# Altium schematic sheet wireless_accelerometer.SchDoc
size A4; Organization: Altium Limited; Address1: L3, 12a Rodborough Rd; Address2: Frenchs Forest; Address3: NSW; Address4: Australia 2086
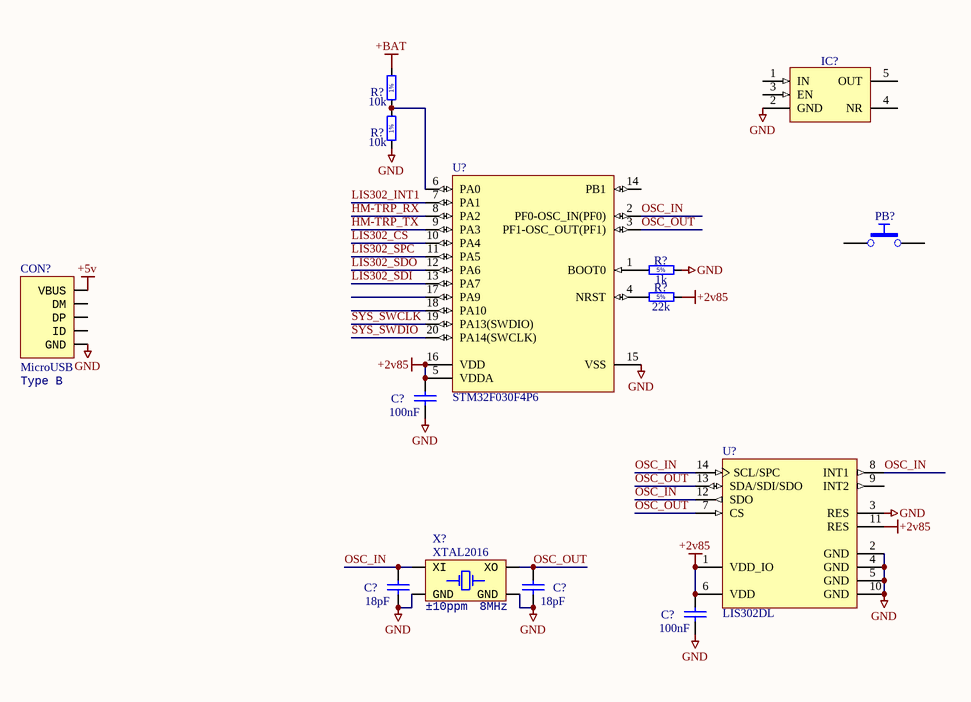
[diagram p0: wireless_accelerometer.SchDoc]

## Parts
(Parts that share a designator on the sheet are numbered #1, #2 ... from top to bottom, then left to right.)
C?#1  100nF  [CAP_0603]
C?#2  18pF  [CAP_0603]
C?#3  18pF  [CAP_0603]
C?#4  100nF  [CAP_0603]
CON?  MicroUSB  value Type B  [USB_Micro-AB]
IC?  TPS73033DBVT  [SOT95P280X145-5N]  (value not drawn)
PB?  Push Button  [PB_TYCO_FSMSM]  (value not drawn)
R?#1  10k  [RES_0603]
R?#2  10k  [RES_0603]
R?#3  1k  [RES_0603]
R?#4  22k  [RES_0603]
U?#1  STM32F030F4P6  [STM-TSSOP20_N]
U?#2  LIS302DL  [LGA14-3X5X1_N]
X?  XTAL2016  value 8MHz  Specification: ±10ppm  [XT_2016_4]

## Nets
+2v85: C?#1.2 C?#4.2 R?#4.2 U?#1.5(VDDA) U?#1.16(VDD) U?#2.1(VDD_IO) U?#2.6(VDD) U?#2.11(RES)
+5v: CON?.1(VBUS)
+BAT: R?#1.2
GND: C?#1.1 C?#2.1 C?#3.1 C?#4.1 CON?.5(GND) IC?.2(GND) R?#2.1 R?#3.2 U?#1.15(VSS) U?#2.2(GND) U?#2.3(RES) U?#2.4(GND) U?#2.5(GND) U?#2.10(GND) X?.2(GND) X?.4(GND)
HM-TRP_RX: U?#1.8(PA2)
HM-TRP_TX: U?#1.9(PA3)
LIS302_CS: U?#1.10(PA4)
LIS302_INT1: U?#1.7(PA1)
LIS302_SDI: U?#1.13(PA7)
LIS302_SDO: U?#1.12(PA6)
LIS302_SPC: U?#1.11(PA5)
OSC_IN: C?#2.2 U?#1.2(PF0-OSC_IN(PF0)) U?#2.8(INT1) U?#2.12(SDO) U?#2.14(SCL/SPC) X?.1(XI)
OSC_OUT: C?#3.2 U?#1.3(PF1-OSC_OUT(PF1)) U?#2.7(CS) U?#2.13(SDA/SDI/SDO) X?.3(XO)
SYS_SWCLK: U?#1.19(PA13(SWDIO))
SYS_SWDIO: U?#1.20(PA14(SWCLK))
NetR?#1_1: R?#1.1 R?#2.2 U?#1.6(PA0)
NetR?#3_1: R?#3.1 U?#1.1(BOOT0)
NetR?#4_1: R?#4.1 U?#1.4(NRST)

Not connected (* = marked no-connect by the designer): CON? 0(SH) 2(DM) 3(DP) 4(ID); IC? 1(IN) 3(EN) 4(NR) 5(OUT); PB? 1 2; U?#1 14(PB1) 17(PA9) 18(PA10); U?#2 9(INT2)

## Notes on the sheet
- Title
- Size:
- Date:
- A4
- Number:
- Time:
- Revision:
- Sheet
- of
- File:
- (in symbol Resistor - 1%) 1%
- (in symbol Resistor - 5%) 5%

## Library data of the parts
C?#1-C?#4 = Capacitor - non polarized: Non-polarised capacitor
CON? = USB_Micro: USB; Type: *; Link: *
IC? = TPS73033DBVT: Single Output LDO, 200mA, Fixed (3.3V), High PSRR, Low Noise; Part Description: Single Output LDO, 200mA, Fixed (3.3V), High PSRR, Low Noise Linear Regulator; Manufacturer: TEXAS INSTRUMENTS; Table: Regulators; Part Number: TPS73033DBVT; Component Kind: Standard; Component Type: Standard; Device: TPS73033DBVT; PackageDescription: SOT, 0.95mm pitch; 5 pin, 1.60mm W X 2.90mm L X 1.45mm H body, IPC Medium Density; Manufacturer Part Number: TPS73033DBVT; Pin Count: 5; Case: SOT23-5; Mounted: Yes; Socket: No; SMD: Yes; ComponentHeight: 1.45mm; HelpURL: \\cern.ch\dfs\Applications\Altium\Datasheets\TPS73033DBVT.pdf; Author: CERN DEM JLC; CreateDate: 26.01.2010; LatestRevisionDate: 26.01.2010
PB? = PB_TYCO_FSMSM: Push-Button Switch SPDT; Part Description: 12VDC 50mA SPST Tactile  Push-Button Switch; Manufacturer: TYCO ELECTRONICS; Manufacturer Part Number: FSMSM or 1437566-3; Table: Switches; Part Number: PB_TYCO_FSMSM; Component Kind: Standard; Component Type: Standard; Pin Count: 2; PackageDescription: Body 3.5x6.0mm, Pushbutton Switch,  TYCO ALCOSWITCH FSMSM Serie; Family: Push Button; Mounted: Yes; Socket: No; SMD: Yes; Status: None; ComponentHeight: 4.3mm; HelpURL: \\cern.ch\dfs\Applications\Altium\Datasheets\PB_TYCO_FSMSM.pdf; Author: CERN DEM JLC; CreateDate: 30.06.2008; LatestRevisionDate: 21.06.2012
R?#1 R?#2 = Resistor - 1%
R?#3 R?#4 = Resistor - 5%
U?#1 = STM32F030F4P6: ARM Cortex-M0 32-bit MCU, 16 KB Flash, 4 KB Internal RAM, 15 I/Os, 20-pin TSSOP, -40 to 85 degC, Tube; FLASH Size (Prog) (kB): 16; I/Os (High Current): 15; Internal RAM Size (kB): 4; Operating Frequency(F) (Processor speed) (MHz): 48; Supply Voltage(Vcc) min (V): 2.4; DatasheetVersion: Rev. 1; PackageVersion: Rev. 1, 11/2012; PackageReference: TSSOP20; PackageDescription: 20-Pin Thin Shrink Small Outline Package, 6.5 x 4.4 mm Body, 0.65 mm Pitch; Supplier 1: Digi-Key; Supplier Part Number 1: 497-14044-5-ND; Supplier 2: Newark; Supplier Part Number 2: 06X3648; Supplier 3: Mouser; Supplier Part Number 3: 511-STM32F030F4P6; Core: ARM Cortex-M0; Packing: Tube; Mounting Technology: Surface Mount; PartNumber: STM32F030F4P6; ComponentLink1Description: Manufacturer URL; ComponentLink1URL: http://www.st.com/web/en/home.html; ComponentLink2Description: Datasheet; ComponentLink2URL: http://www.st.com/st-web-ui/static/active/en/resource/technical/document/datasheet/DM00088500.pdf; ComponentLink3Description: Package Specification; ComponentLink3URL: http://www.st.com/st-web-ui/static/active/en/resource/technical/document/datasheet/DM00065136.pdf
U?#2 = LIS302DL: MEMS motion sensor 3-axis - ± 2g/± 8g smart digital output piccolo accelerometer, -40 to +85°C, LGA-14 (3x5x1), Tray; Manufacturer: STMicroelectronics; DatasheetVersion: rev4, Oct-2008; PackageVersion: 2011; PackageReference: LGA14-3X5X1; PackageDescription: 14-Lead Land Grid Array Package, 5 x 3 x 1 mm Body, 0.8 mm Pitch; ComponentLink1Description: Manufacturer URL; ComponentLink1URL: http://www.st.com/; ComponentLink2Description: LIS302DL Datasheet; ComponentLink2URL: http://www.st.com/internet/com/TECHNICAL_RESOURCES/TECHNICAL_LITERATURE/DATASHEET/CD00135460.pdf; ComponentLink3Description: LIS302DL Web Page; ComponentLink3URL: http://www.st.com/internet/analog/product/152913.jsp
X? = XTAL_2016_4P: Crystal Oscillator; Type: XTAL2016_4P; Manufacturer: *; Note: *